# Altium schematic sheet Sheet1.SchDoc
size A4; SheetNumber: 1; SheetTotal: 1
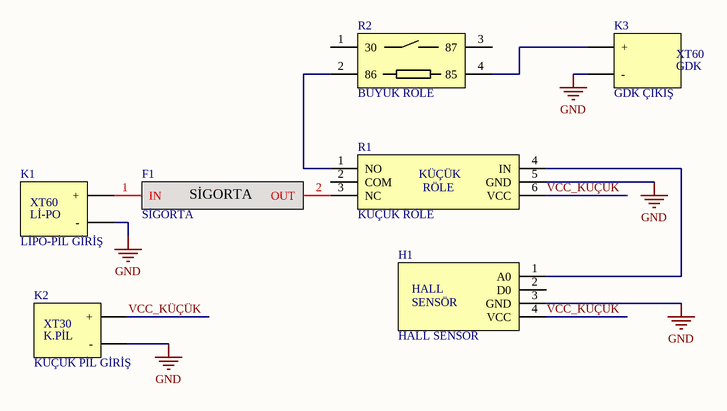
[diagram p0: Sheet1.SchDoc]

## Parts
F1  SİGORTA
H1  HALL SENSÖR  [HALL SENSÖR]
K1  LİPO-PİL GİRİŞ  [LİPO-PİL GİRİŞ]
K2  KÜÇÜK PİL GİRİŞ  [KÜÇÜK PİL GİRİŞ]
K3  GDK ÇIKIŞ  [GDK ÇIKIŞ]
R1  KÜÇÜK RÖLE  [KÜÇÜK RÖLE]
R2  BÜYÜK RÖLE  [BÜYÜK RÖLE]

## Nets
GND: H1.3(GND) K1.2(-) K2.N(-) K3.2(-) R1.5(GND)
VCC_KÜÇÜK: H1.4(VCC) K2.P(+) R1.6(VCC)
NetF1_1: F1.1(IN) K1.1(+)
NetF1_2: F1.2(OUT) R1.3(NC)
NetH1_1: H1.1(A0) R1.4(IN)
NetK3_1: K3.1(+) R2.4(85)
NetR1_1: R1.1(NO) R2.2(86)

Not connected (* = marked no-connect by the designer): H1 2(D0); R1 2(COM); R2 1(30) 3(87)

## Notes on the sheet
- (in symbol GDK ÇIKIŞ) XT60; GDK
- (in symbol HALL SENSÖR) HALL; SENSÖR
- (in symbol KÜÇÜK PİL GİRİŞ) XT30; K.PİL
- (in symbol KÜÇÜK RÖLE) KÜÇÜK; RÖLE
- (in symbol LİPO-PİL GİRİŞ) XT60; Lİ-PO